# EAGLE design WiiCamBoard (EAGLE 7.2.0)
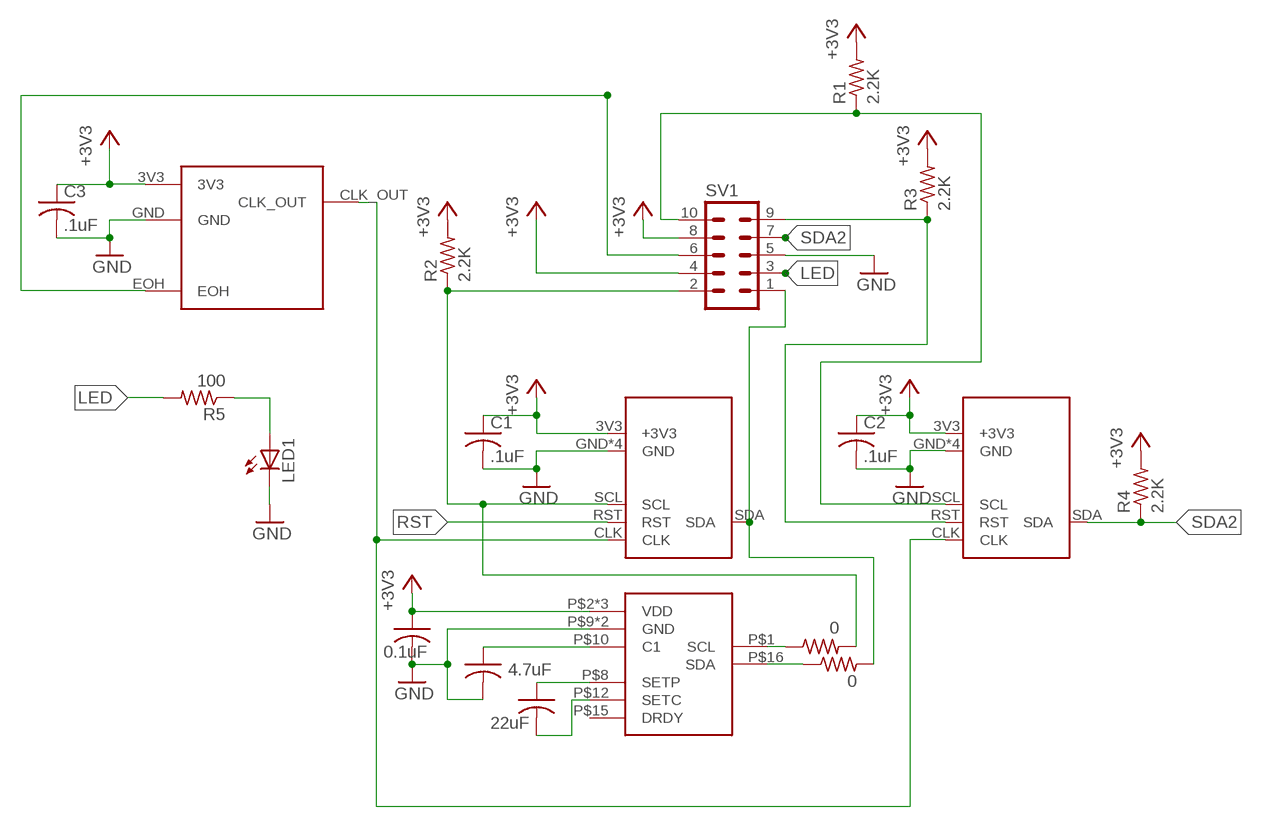
[diagram p0: schematic, sheet 1]

## Parts
C1  .1uF  C-USC0805  [C0805]
C2  .1uF  C-USC0805  [C0805]
C3  .1uF  C-USC0805  [C0805]
C4  0.1uF  C-USC0805  [C0805]
C5  4.7uF  C-USC0805  [C0805]
C6  22uF  C-USC0805  [C0805]
LED1  LED5MM  [LED5MM]
R1  2.2K  R-US_M0805  [M0805]
R2  2.2K  R-US_M0805  [M0805]
R3  2.2K  R-US_M0805  [M0805]
R4  2.2K  R-US_M0805  [M0805]
R5  100  R-US_M0805  [M0805]
R6  0  R-US_R0805  [R0805]
R7  0  R-US_R0805  [R0805]
SV1  MA05-2  [MA05-2]
U$1  WII_IR_CAM  [WII_IR_CAM]
U$2  WII_IR_CAM  [WII_IR_CAM]
U$3  CB3LV-3C  [CB3LV-3C]
U$4  HMC5883L  [HMC5883L]

## Nets
+3V3: C1.1 C2.1 C3.1 C4.1 R1.2 R2.2 R3.2 R4.2 SV1.4 SV1.8 U$1.3V3(+3V3) U$2.3V3(+3V3) U$3.3V3 U$4.P$2(VDD) U$4.P$4(VDD) U$4.P$13(VDD)
CLK: U$1.CLK U$2.CLK U$3.CLK_OUT
GND: C1.2 C2.2 C3.2 C4.2 C5.2 LED1.K(C) SV1.5 U$1.GND U$1.GND2(GND) U$1.GND3(GND) U$1.GND4(GND) U$2.GND U$2.GND2(GND) U$2.GND3(GND) U$2.GND4(GND) U$3.GND U$4.P$9(GND) U$4.P$11(GND)
LED: R5.2 SV1.3
N$1: LED1.A R5.1
N$2: R6.1 U$4.P$1(SCL)
N$3: R7.1 U$4.P$16(SDA)
N$4: C6.1 U$4.P$8(SETP)
N$5: C6.2 U$4.P$12(SETC)
N$6: C5.1 U$4.P$10(C1)
N$8: SV1.6 U$3.EOH
RST: R3.1 SV1.9 U$1.RST U$2.RST
SCL: R2.1 R6.2 SV1.2 U$1.SCL
SCL2: R1.1 SV1.10 U$2.SCL
SDA1: R7.2 SV1.1 U$1.SDA
SDA2: R4.1 SV1.7 U$2.SDA
Unconnected: U$4.P$15(DRDY)

## Library data of the parts
C1-C6 = rcl:C-US: CAPACITOR, American symbol
LED1 = adafruit:LED: LED OSRAM: - CHIPLED LG R971, LG N971, LY N971, LG Q971, LY Q971, LO R971, LY R971 LH N974, LH R974 LS Q976, LO Q976, LY Q976 LO Q996 - Hyper CHIPLED LW Q18S LB Q993, LB Q99A, LB R99A - SideLED LS A670, LO A670, LY A670, LG A670, LP A670 LB A673, LV A673, LT A673, LW A673 LH A674 LY A675 LS A676, LA A676, LO A676, LY A676, LW A676 LS A679, LY A679, LG A679 - Hyper Micro SIDELED® LS Y876, LA Y876, LO Y876, LY Y876 LT Y87S - SmartLED LW L88C, LW L88S LB L89C, LB L89S, LG L890 LS L89K, LO L89K, LY L89K LS L896, LA L896, LO L896, LY L896 - TOPLED LS T670, LO T670, LY T670, LG T670, LP T670 LSG T670, LSP T670, LSY T670, LOP T670, LYG T670 LG T671, LOG T671, LSG T671 LB T673, LV T673, LT T673, LW T673 LH T674 LS T676, LA T676, LO T676, LY T676, LB T676, LH T676, LSB T676, LW T676 LB T67C, LV T67C, LT T67C, LS T67K, LO T67K, LY T67K, LW E67C LS E67B, LA E67B, LO E67B, LY E67B, LB E67C, LV E67C, LT E67C LW T67C LS T679, LY T679, LG T679 LS T770, LO T770, LY T770, LG T770, LP T770 LB T773, LV T773, LT T773, LW T773 LH T774 LS E675, LA E675, LY E675, LS T675 LS T776, LA T776, LO T776, LY T776, LB T776 LHGB T686 LT T68C, LB T68C - Hyper Mini TOPLED® LB M676 - Mini TOPLED Santana® LG M470 LS M47K, LO M47K, LY M47K Source: http://www.osram.convergy.de/
R1-R5 = resistor:R-US_: RESISTOR, American symbol
R6 R7 = rcl:R-US_: RESISTOR, American symbol
SV1 = con-lstb:MA05-2: PIN HEADER; OC_FARNELL: unknown; OC_NEWARK: unknown
U$1 U$2 = WII_IR_CAM:WII_IR_CAM
U$3 = CB3LV-3C:CB3LV-3C
U$4 = HMC5883L:HMC5883L

## Board
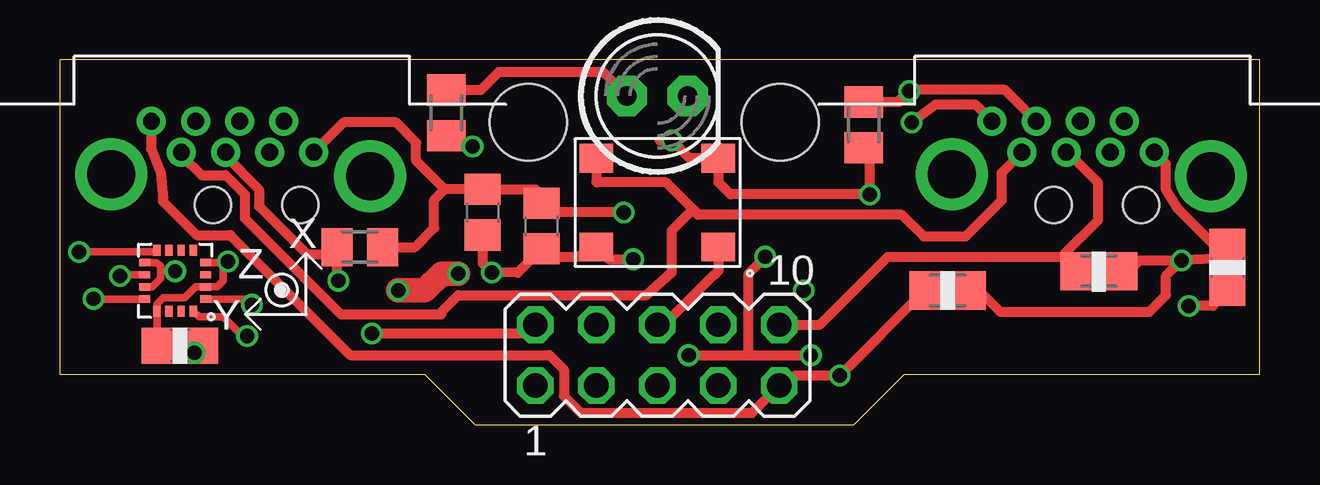
[diagram p1: board, top side]
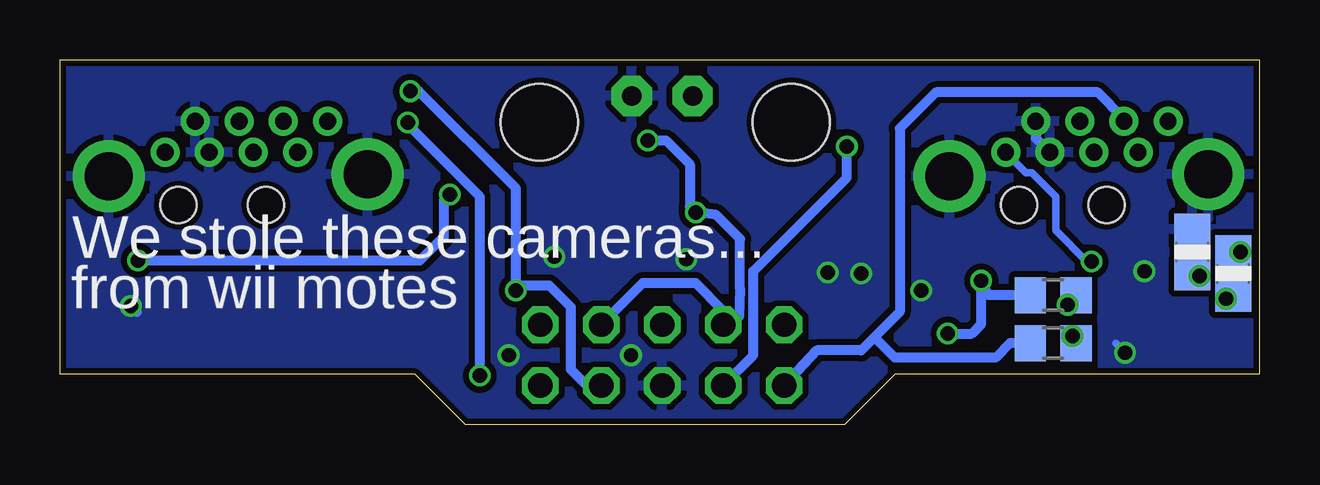
[diagram p2: board, bottom side, seen from below]

Size 50 x 15.2 mm. Coordinates in mm from the lower left corner, seen from the top.
Outline: 50,15.2 0,15.2 0,2.1 15.2,2.1 17.3,0 33.1,0 35.2,2.1 50,2.1 50,15.2
Copper layers (1*16): Top 0.035mm / dielectric 1.5mm / Bottom 0.035mm
Design rules "dirt_cheap_dirty_boards.v1": minimum track width 5mil, minimum drill 12mil, track to track 5mil, track to pad 5mil, pad to pad 5mil, via to via 5mil, smd to smd 0mil, copper to edge 10mil, drill to drill 10mil, minimum pad ring 10mil, minimum via ring 6mil, stop-mask expansion 2mil, vias tented up to drill 25mil, thermal gap 10mil
Holes 3.2 mm at 30.02,12.61 19.52,12.61

### Footprints (pad centres in the part's own frame; a part is rotated, then mirrored left to right if it is on the bottom)
C0805 = smd 1.3 x 1.5: 1 -0.95,0; 2 0.95,0
LED5MM = drill 0.813 pad 1.676 octagon: A -1.27,0; K 1.27,0
M0805 = smd 1.3 x 1.6: 1 -0.95,0; 2 0.95,0
R0805 = smd 1.3 x 1.5: 1 -0.95,0; 2 0.95,0
MA05-2 = drill 1.016 octagon: 1 -5.08,-1.27; 2 -5.08,1.27; 3 -2.54,-1.27; 4 -2.54,1.27; 5 0,-1.27; 6 0,1.27; 7 2.54,-1.27; 8 2.54,1.27; 9 5.08,-1.27; 10 5.08,1.27
WII_IR_CAM = drill 0.7: 3V3 0,0; CLK 5.52,0; GND 1.84,0; GND2 1.25,-1.3; NC 3.09,-1.3; RST 6.77,-1.3; SCL 3.68,0; SDA 4.93,-1.3 | drill 2: GND3 -2.35,1; GND4 8.45,0.91 | hole 1.5: 0.56,2.2; 4.2,2.2
CB3LV-3C = smd 1.4 x 1.2: 3V3 5.08,3.7; CLK_OUT 0,3.7; EOH 5.08,0; GND 0,0
HMC5883L = smd 0.457 x 0.305: P$1 -1.27,0.762; P$2 -1.27,0.254; P$3 -1.27,-0.254; P$4 -1.27,-0.762; P$9 1.27,-0.762; P$10 1.27,-0.254; P$11 1.27,0.254; P$12 1.27,0.762 | smd 0.305 x 0.457: P$5 -0.762,-1.27; P$6 -0.254,-1.27; P$7 0.254,-1.27; P$8 0.762,-1.27; P$13 0.762,1.27; P$14 0.254,1.27; P$15 -0.254,1.27; P$16 -0.762,1.27

### Placement (x,y rotation side)
C1  48.66,6.56 270 top
C2  17.62,8.86 270 top
C3  20.07,8.28 270 top
C4  5,3.3 0 top
C5  2.8,7.2 90 bottom
C6  1.1,6.3 270 bottom
LED1  24.9,13.7 0 top
R1  43.3,6.4 0 top
R2  12.5,7.4 0 top
R3  37,5.6 0 top
R4  33.5,12.5 270 top
R5  16.1,13 270 top
R6  8.6,5.4 180 bottom
R7  8.6,3.4 180 bottom
SV1  24.9,2.9 0 top
U$1  10.58,11.35 180 top
U$2  45.62,11.35 180 top
U$3  22.36,7.41 0 top
U$4  4.8,6 180 top

### Tracks (layer width: path | path; a pad name or v marks a point on that pad's centre or on a via)
+3V3  (via drill 0.6)
  Top 0.305: C4.1 4.05,4.72 | 4.05,4.72 U$4.P$13 | 4.05,4.72 4.05,5.05 4.3,5.3 5.2,5.3 5.65,5.75 U$4.P$2 6.55,5.75 6.8,6 6.8,6.6 v7,6.8 6.56,6.76 U$4.P$4
  Top 0.406: v23.5,8.85 20.79,8.85 | 20.79,8.85 C3.1 | 16.04,9.81 C2.1 19.83,9.81 20.79,8.85 | 16.04,9.81 14.85,11 14.85,11.75 14,12.6 11.83,12.6 U$1.3V3 | C1.1 48.66,6.94 | 48.66,6.94 v46.75,6.85 | 48.66,6.94 46.6,9 46.1,9.8 46.1,10.87 U$2.3V3 | 25,11.85 v25.5,11.85 26.24,11.11 U$3.3V3 27.44,10.11 27.95,9.6 v33.75,9.6 33.75,11.3 R4.2 | R3.2 38,5.9 39.2,4.7 45.4,4.7 46.1,5.4 46.1,6.2 v46.75,6.85 | R1.2 44.55,6.4 45,6.85 v46.75,6.85 | R2.2 14.8,7.4 15.6,8.2 15.6,9.37 16.04,9.81
  Bottom 0.305: v7,6.8 7.2,6.8 8.5,8.1 8.5,9.5 9.5,10.5 9.73,10.5 U$1.3V3
  Bottom 0.406: v25.5,11.85 24.75,11.85 23.75,10.85 23.75,9.1 v23.5,8.85 22.65,8.75 21.65,7.75 21.65,5.65 21.7,4.5 21.73,4.5 SV1.4 22.36,4.76 23.5,5.9 25.71,5.9 SV1.8 | v46.75,6.85 35,6.85 34,7.85 34,9.35 v33.75,9.6
CLK
  Top 0.406: 26.38,8.98 26.6,8.75 35.1,8.75 36,7.85 37.75,7.85 39.25,9.35 39.25,10.5 U$2.CLK | 26.38,8.98 25.25,10.1 22.37,10.1 22.36,10.11 U$3.CLK_OUT | 26.38,8.98 25.5,8.1 25.5,6.35 24.45,5.4 16.6,5.4 15.9,4.7 15.9,4.6 11.7,4.6 7.7,8.6 7.7,9.6 6.9,10.4 5.9,10.4 5.06,11.24 U$1.CLK
GND  (via drill 0.6)
  Top 0.305: C4.2 5.9,3.3 v5.6,3 | U$4.P$11 3.85,5.75 4.2,6.1 4.2,6.4 | U$4.P$9 4.04,6.76 4.2,6.6 4.2,6.4 | 4.2,6.4 v4.8,6.4
  Top 0.406: C2.2 17.62,6.73 v18,6.35 19.08,6.33 C3.2 20.45,7.01 21.56,7.01 U$3.GND 22.87,6.9 v23.9,6.9 | C1.2 48.06,4.96 v47.05,4.95 | v26.2,2.9 28.7,2.9 | 28.7,2.9 v31.3,2.9 | 28.7,2.9 28.7,6.3 v29.4,7
  Top 1.016: v14.1,5.6 15.2,5.6 15.9,6.3 v16.6,6.3
  Bottom 0.305: v5.6,3 6,3.4 | v4.8,6.4 5,6.4
  Bottom 0.406: v18,6.35 17.75,6.35 | v47.05,4.95 46.8,4.7 | 24,6.9 v23.9,6.9 | U$1.GND2 9.33,11.94 U$1.GND
  pour Bottom (isolate 0.254): -2.45,-1 51.98,-0.55 52.28,17.15 -2.05,17.25
LED  (via drill 0.6)
  Top 0.406: v17.2,11.6 R5.2
  Bottom 0.406: SV1.3 21.1,2.9 21.1,6.4 17.2,10.3 v17.2,11.6
N$1
  Top 0.406: R5.1 17.55,13.95 18.3,14.7 22.63,14.7 LED1.A
N$2  (via drill 0.6)
  Top 0.305: U$4.P$1 7.76,5.24 v8,5
  Bottom 0.305: v8,5 8,5.05 R6.1
N$3  (via drill 0.6)
  Top 0.305: v7.8,3.7 7.6,3.7 6.8,4.5 5.79,4.5 U$4.P$16
  Bottom 0.305: R7.1 7.65,3.55 v7.8,3.7
N$4  (via drill 0.6)
  Top 0.305: v0.8,7.2 3.97,7.2 U$4.P$8
  Bottom 0.305: C6.1 0.85,7.2 v0.8,7.2
N$5  (via drill 0.6)
  Top 0.305: v1.4,5.25 1.41,5.24 U$4.P$12
  Bottom 0.305: C6.2 1,5.25 v1.4,5.25
N$6  (via drill 0.6)
  Top 0.305: v2.5,6.2 2.35,6.25 U$4.P$10
  Bottom 0.305: C5.1 2.35,6.25 v2.5,6.2
N$8
  Top 0.406: U$3.EOH 27.44,6.41 27.25,6.22 27.22,6.22 25.17,4.17 SV1.6
RST  (via drill 0.6)
  Top 0.406: v35.5,12.6 36.5,13.35 38.15,13.35 U$2.RST | R3.1 v32.5,2.05 30.65,2.05 30,1.4 30,1.55 SV1.9 28.85,0.5 21.7,0.5 21,1.2 21,2.3 20.4,2.9 12.1,2.9 7.1,7.9 5.7,7.9 4.3,9.3 4.3,9.4 4.2,10.5 3.8,11.5 U$1.RST
  Bottom 0.406: v32.5,2.05 32.5,9.5 35.5,12.5 v35.5,12.6
SCL  (via drill 0.6)
  Top 0.406: U$1.SCL 6.9,11.2 8.3,9.8 8.3,9.1 10.3,7.1 11.25,7.1 R2.1 11.55,5.95 v11.6,6 | SV1.2 19.45,3.8 v13,3.8
  Bottom 0.406: v13,3.8 12,3.8 11.6,4.2 v11.6,6 11.3,5.4 R6.2
SCL2
  Top 0.406: U$2.SCL 42,11.35 43.25,10.1 43.25,8.5 41.85,7.1 41.9,7 | 41.9,7 34.5,7 31.67,4.17 SV1.10 | 41.9,7 41.9,6.5 42.3,6.45 R1.1
SDA1
  Bottom 0.406: U$1.SDA 5.65,12.75 6.75,13.85 13.5,13.85 15,12.35 15,4.7 16.05,3.65 | 16.05,3.65 16.6,3.1 18.45,3.1 SV1.1 | R7.2 10.4,3.4 11,2.8 15.2,2.8 16.05,3.65
SDA2  (via drill 0.6)
  Top 0.406: U$2.SDA 39.39,13.95 35.45,13.95 v35.4,13.9 34.95,13.45 R4.1
  Bottom 0.406: SV1.7 27.73,1.33 28.7,2.3 28.7,4.9 29.6,5.8 30.8,5.8 v31,5.6 31,9.85 35.05,13.9 v35.4,13.9

### Text on the board
bNames: We stole these cameras... | from wii motes
tValues: eyeball #1 | eyeball #2 | * | 10 | I see you | 1